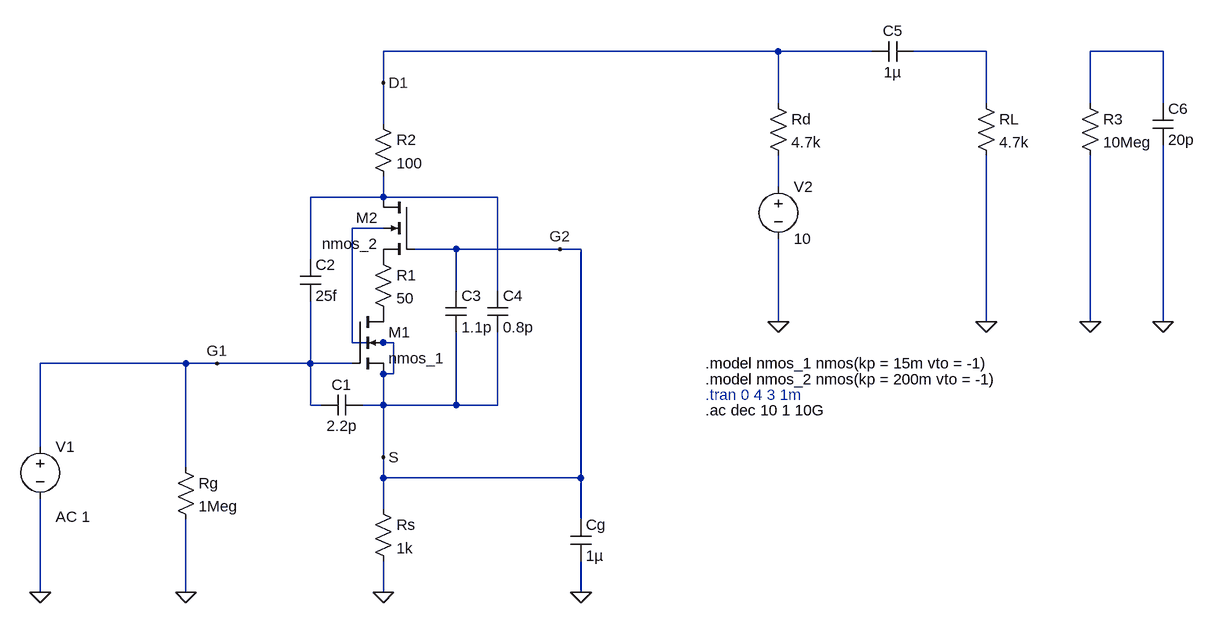
[diagram p0: schematic simu_cascode.asc]
simu_cascode.asc, the LTspice schematic file:
Version 4
SHEET 1 1384 680
WIRE 736 -224 128 -224
WIRE 880 -224 736 -224
WIRE 1056 -224 944 -224
WIRE 1328 -224 1216 -224
WIRE 128 -176 128 -224
WIRE 736 -144 736 -224
WIRE 1056 -144 1056 -224
WIRE 1216 -144 1216 -224
WIRE 1328 -144 1328 -224
WIRE 128 -112 128 -176
WIRE 736 -16 736 -64
WIRE 128 0 128 -32
WIRE 128 0 16 0
WIRE 304 0 128 0
WIRE 128 48 80 48
WIRE 240 80 176 80
WIRE 400 80 240 80
WIRE 432 80 400 80
WIRE 16 96 16 0
WIRE 240 144 240 80
WIRE 304 144 304 0
WIRE 736 192 736 64
WIRE 1056 192 1056 -64
WIRE 1216 192 1216 -64
WIRE 1328 192 1328 -80
WIRE 80 224 80 48
WIRE 128 224 80 224
WIRE 144 224 128 224
WIRE -176 256 -400 256
WIRE -128 256 -176 256
WIRE 16 256 16 160
WIRE 16 256 -128 256
WIRE 80 256 16 256
WIRE 144 272 144 224
WIRE 144 272 128 272
WIRE 16 320 16 256
WIRE 32 320 16 320
WIRE 128 320 128 272
WIRE 128 320 96 320
WIRE 240 320 240 208
WIRE 240 320 128 320
WIRE 304 320 304 208
WIRE 304 320 240 320
WIRE -400 384 -400 256
WIRE 128 400 128 320
WIRE -176 416 -176 256
WIRE 128 432 128 400
WIRE 432 432 432 80
WIRE 432 432 128 432
WIRE 128 480 128 432
WIRE 432 496 432 432
WIRE -400 608 -400 464
WIRE -176 608 -176 496
WIRE 128 608 128 560
WIRE 432 608 432 560
FLAG 128 -176 D1
FLAG 400 80 G2
FLAG 128 400 S
FLAG -128 256 G1
FLAG 128 608 0
FLAG 432 608 0
FLAG -176 608 0
FLAG -400 608 0
FLAG 736 192 0
FLAG 1056 192 0
FLAG 1216 192 0
FLAG 1328 192 0
SYMBOL nmos4 80 176 R0
SYMATTR InstName M1
SYMATTR Value nmos_1
SYMBOL nmos4 176 0 M0
SYMATTR InstName M2
SYMATTR Value nmos_2
SYMBOL res 112 80 R0
SYMATTR InstName R1
SYMATTR Value 50
SYMBOL res 112 -128 R0
SYMATTR InstName R2
SYMATTR Value 100
SYMBOL cap 96 304 R90
WINDOW 0 0 32 VBottom 2
WINDOW 3 32 32 VTop 2
SYMATTR InstName C1
SYMATTR Value 2.2p
SYMBOL cap 0 96 R0
SYMATTR InstName C2
SYMATTR Value 25f
SYMBOL cap 224 144 R0
SYMATTR InstName C3
SYMATTR Value 1.1p
SYMBOL cap 288 144 R0
SYMATTR InstName C4
SYMATTR Value 0.8p
SYMBOL res 112 464 R0
SYMATTR InstName Rs
SYMATTR Value 1k
SYMBOL cap 416 496 R0
SYMATTR InstName Cg
SYMATTR Value 1µ
SYMBOL res -192 400 R0
SYMATTR InstName Rg
SYMATTR Value 1Meg
SYMBOL voltage -400 368 R0
WINDOW 123 24 124 Left 2
WINDOW 39 0 0 Left 0
SYMATTR Value2 AC 1
SYMATTR InstName V1
SYMATTR Value ""
SYMBOL res 720 -160 R0
SYMATTR InstName Rd
SYMATTR Value 4.7k
SYMBOL voltage 736 -32 R0
SYMATTR InstName V2
SYMATTR Value 10
SYMBOL cap 944 -240 R90
WINDOW 0 0 32 VBottom 2
WINDOW 3 32 32 VTop 2
SYMATTR InstName C5
SYMATTR Value 1µ
SYMBOL res 1040 -160 R0
SYMATTR InstName RL
SYMATTR Value 4.7k
SYMBOL res 1200 -160 R0
SYMATTR InstName R3
SYMATTR Value 10Meg
SYMBOL cap 1312 -144 R0
SYMATTR InstName C6
SYMATTR Value 20p
TEXT 624 256 Left 2 !.model nmos_1 nmos(kp = 15m vto = -1)
TEXT 624 280 Left 2 !.model nmos_2 nmos(kp = 200m vto = -1)
TEXT 624 304 Left 2 ;.tran 0 4 3 1m
TEXT 624 328 Left 2 !.ac dec 10 1 10G

The netlist it stands for:
* simu_cascode.asc
M1 P001 G1 S S nmos_1
M2 N004 S P002 S nmos_2
R1 P002 P001 50
R2 D1 N004 100
C1 S G1 2.2p
C2 N004 G1 25f
C3 S S 1.1p
C4 N004 S 0.8p
Rs S 0 1k
Cg S 0 1µ
Rg G1 0 1Meg
V1 G1 0 AC 1
Rd D1 N003 4.7k
V2 N003 0 10
C5 N001 D1 1µ
RL N001 0 4.7k
R3 N002 0 10Meg
C6 N002 0 20p
.model NMOS NMOS
.model PMOS PMOS
.lib standard.mos
.model nmos_1 nmos(kp = 15m vto = -1)
.model nmos_2 nmos(kp = 200m vto = -1)
* .tran 0 4 3 1m
.ac dec 10 1 10G
.backanno
.end